# EAGLE schematic schematic_March8 (EAGLE 9.3.0)
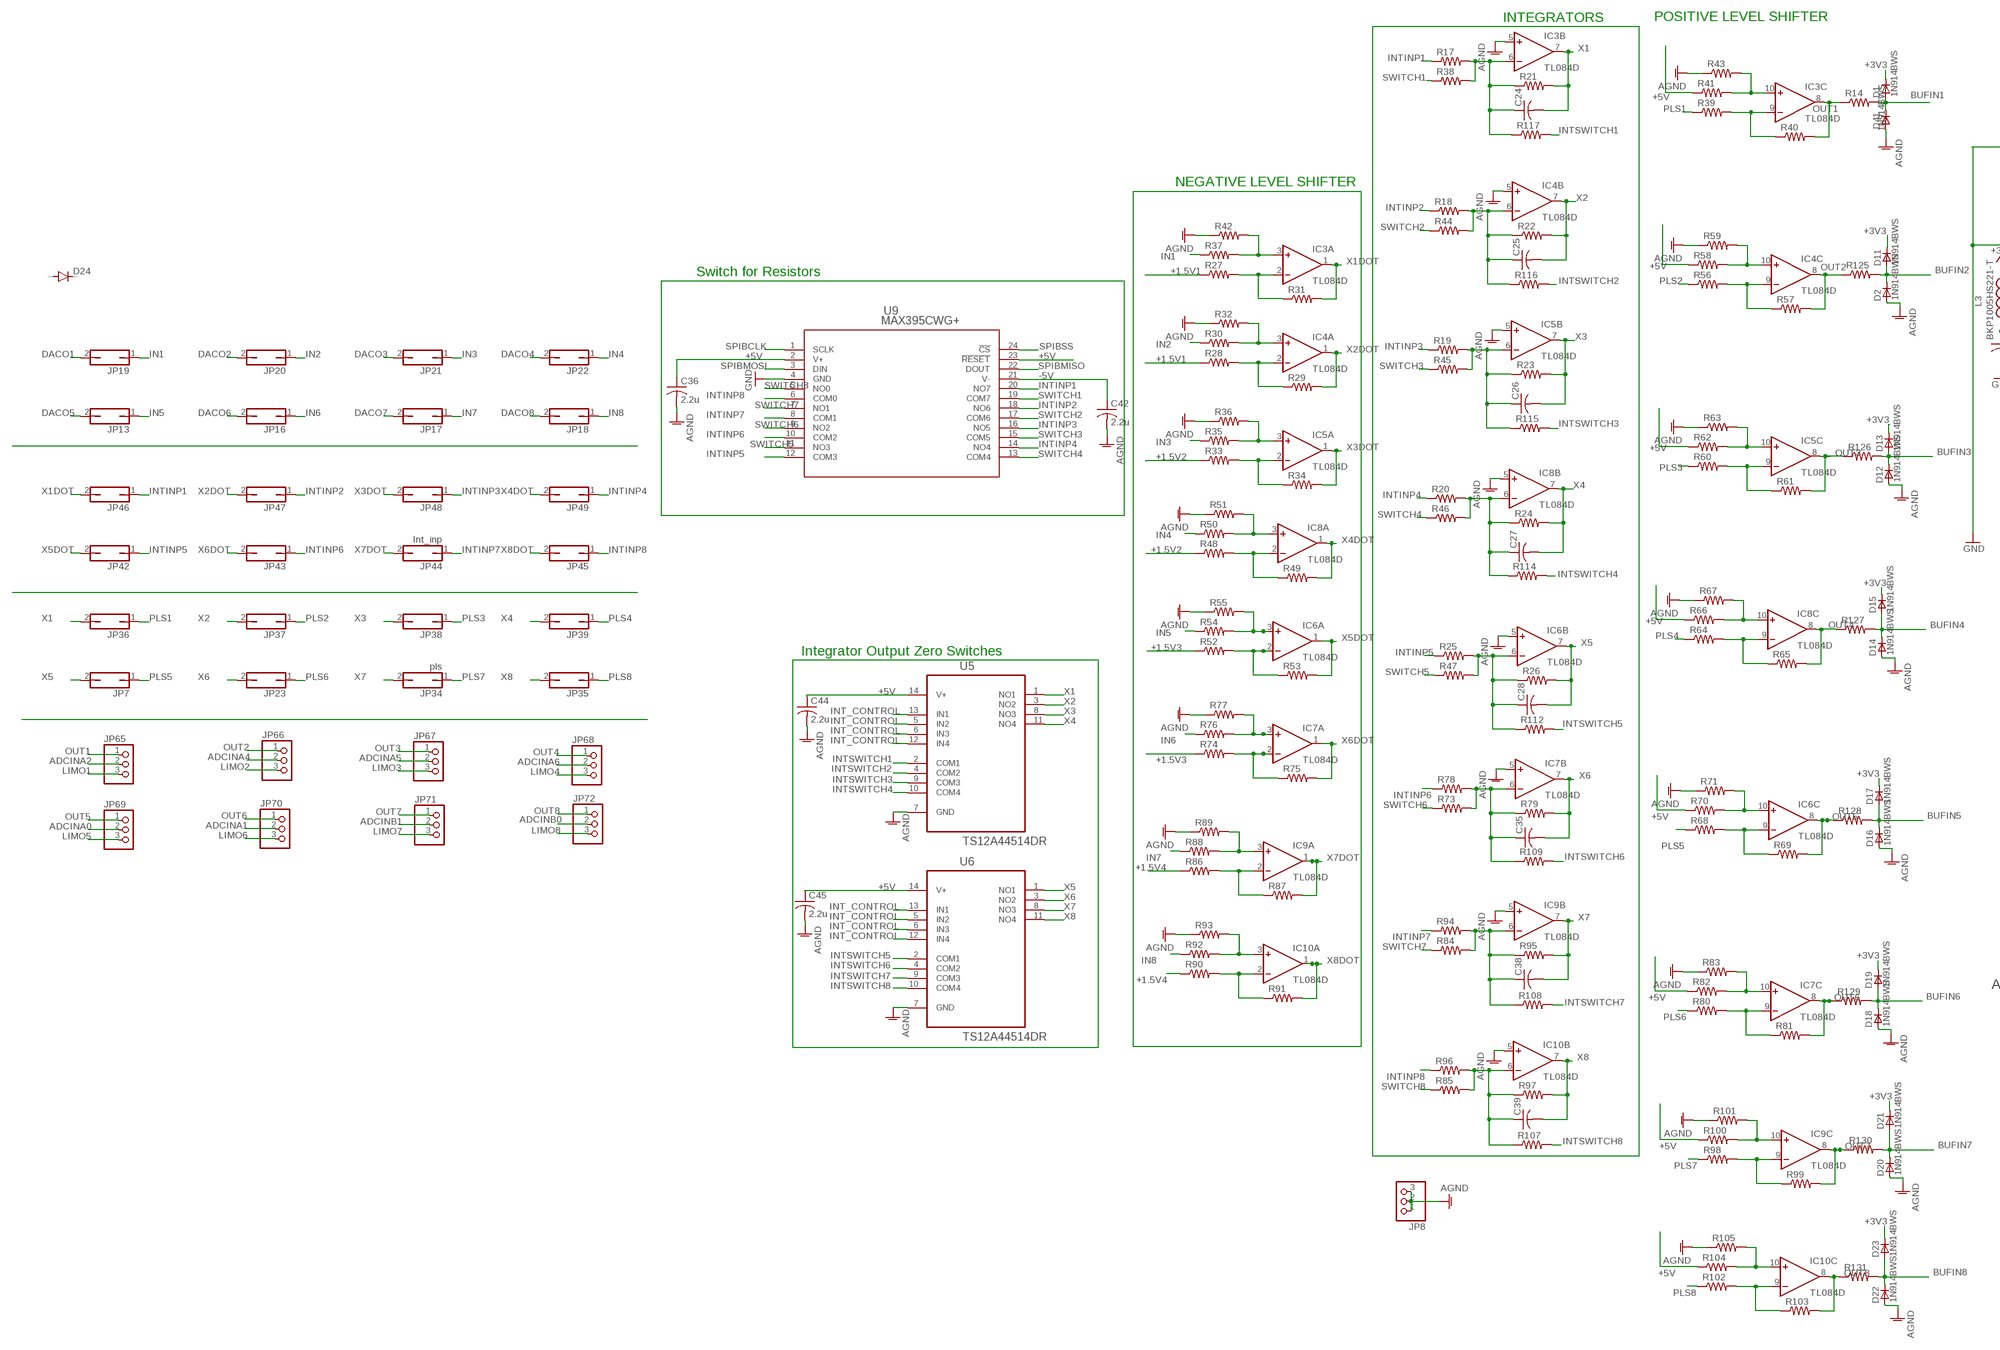
[diagram p0: schematic, sheet 1, part 1 of 2]
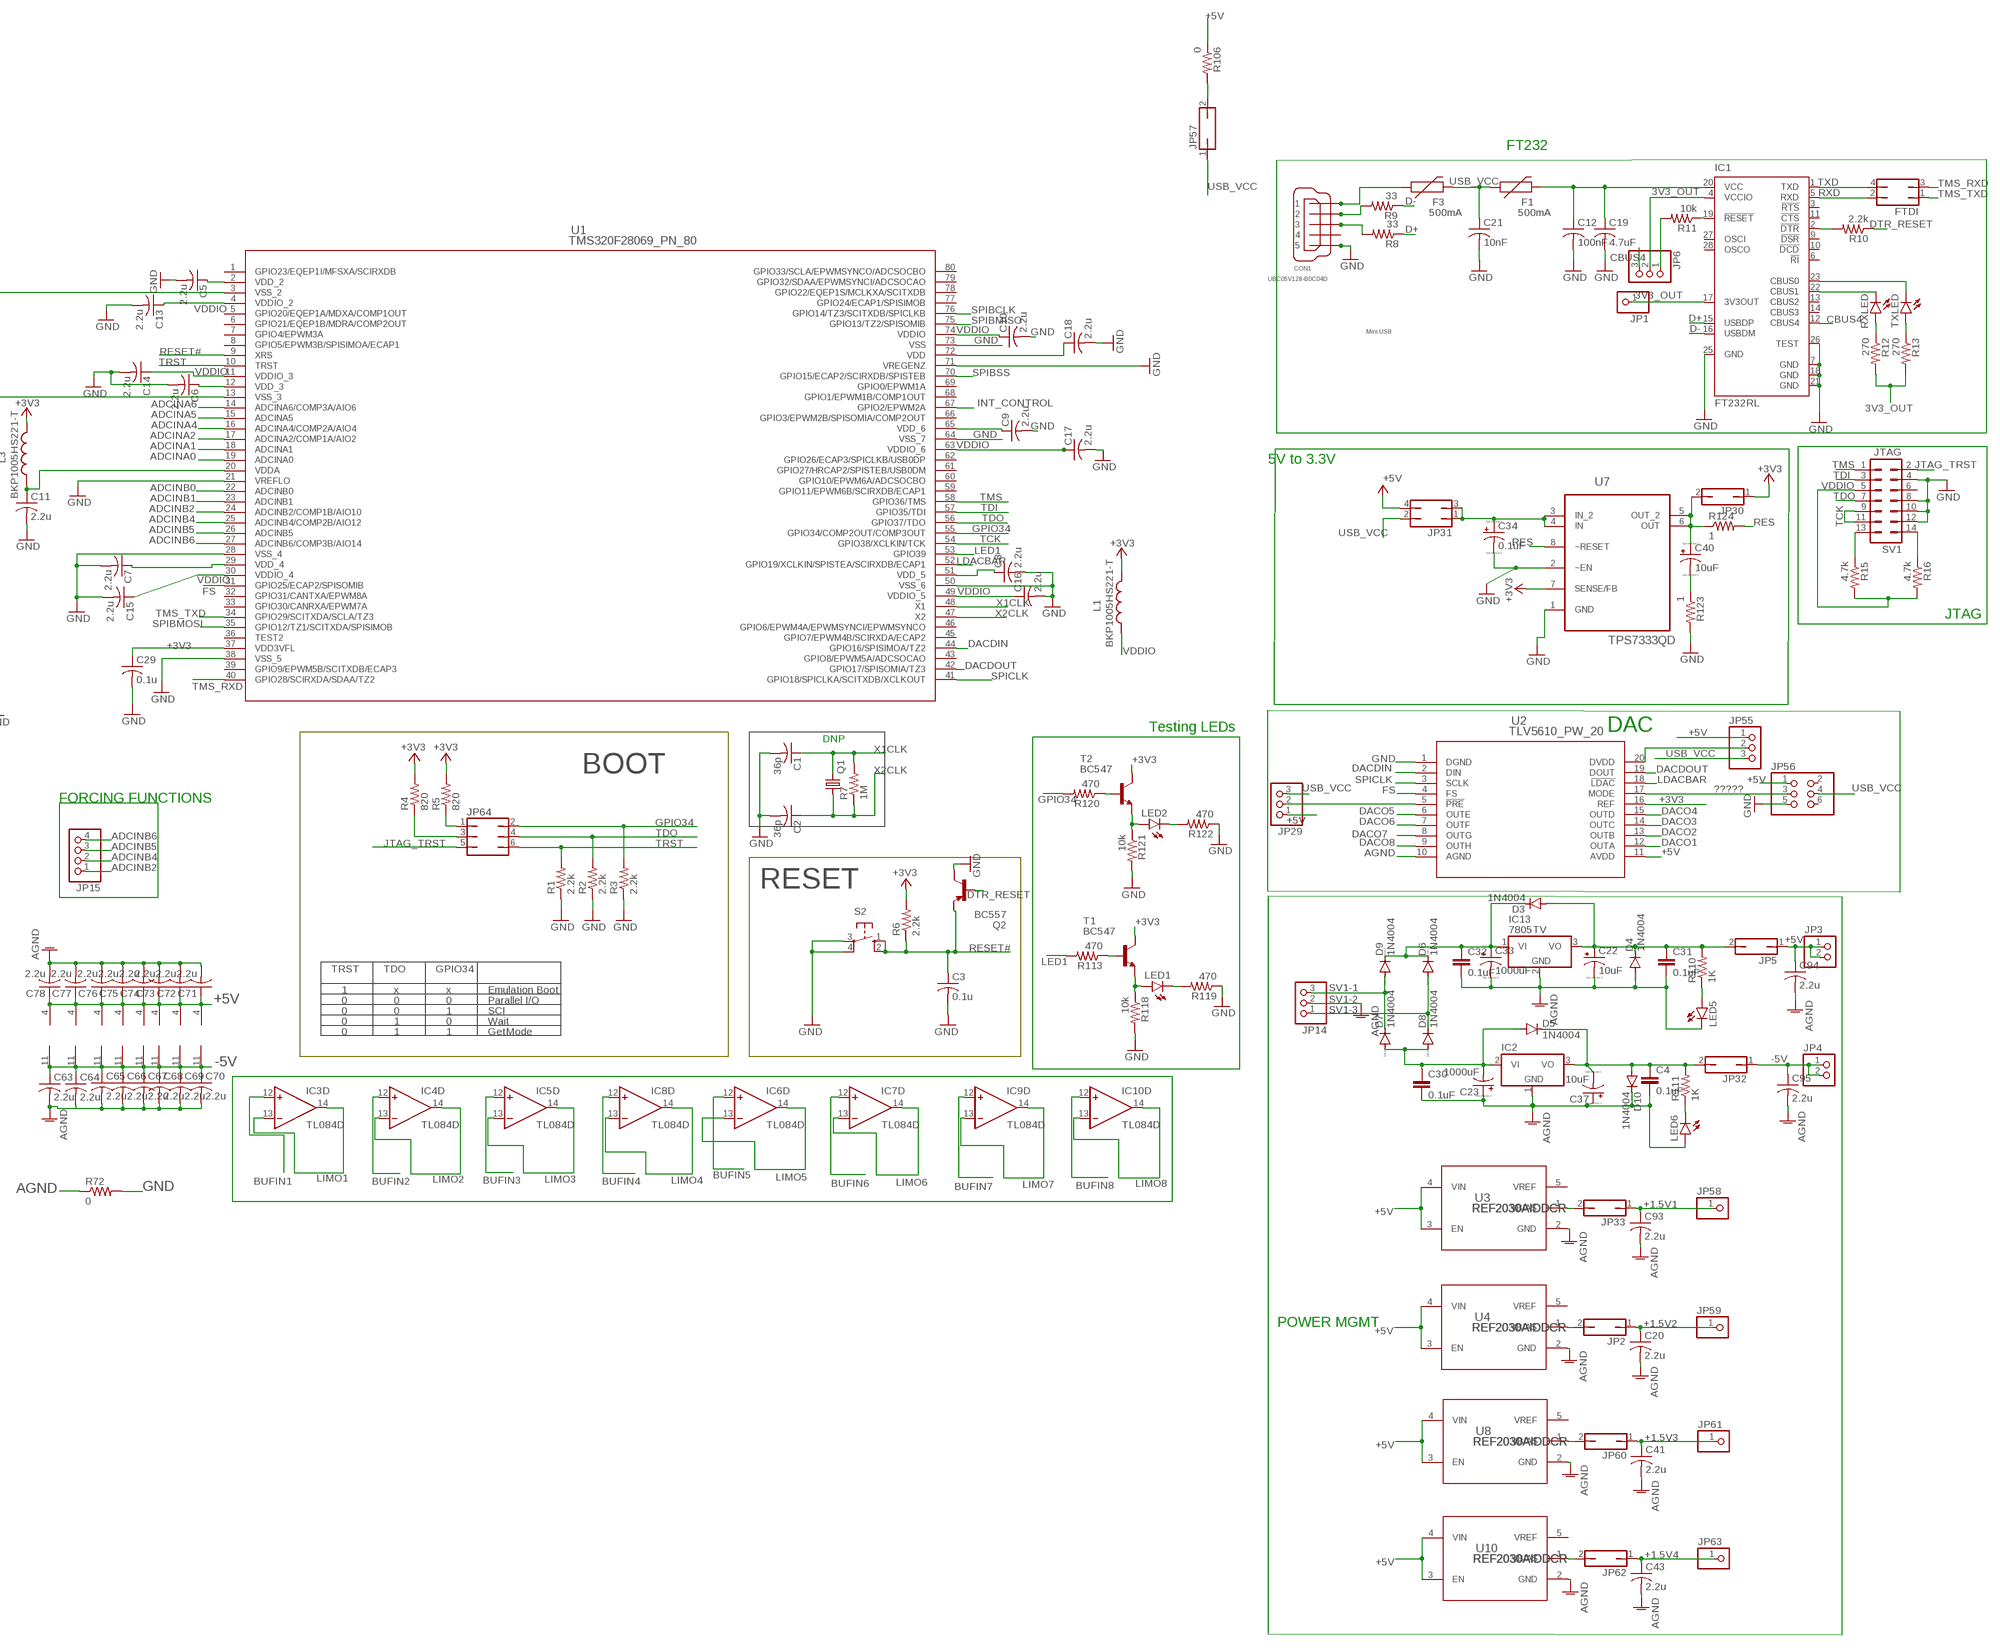
[diagram p1: schematic, sheet 1, part 2 of 2]

## Parts
C1  36p  C-USC1206  [C1206]
C2  36p  C-USC1206  [C1206]
C3  0.1u  C-USC1206  [C1206]
C4  0.1uF  C-EUC1206  [C1206]
C5  2.2u  C-USC1206  [C1206]
C6  2.2u  C-USC1206  [C1206]
C7  2.2u  C-USC1206  [C1206]
C8  2.2u  C-USC1206  [C1206]
C9  2.2u  C-USC1206  [C1206]
C10  2.2u  C-USC1206  [C1206]
C11  2.2u  C-USC1206  [C1206]
C12  100nF  C-USC1206  [C1206]
C13  2.2u  C-USC1206  [C1206]
C14  2.2u  C-USC1206  [C1206]
C15  2.2u  C-USC1206  [C1206]
C16  2.2u  C-USC1206  [C1206]
C17  2.2u  C-USC1206  [C1206]
C18  2.2u  C-USC1206  [C1206]
C19  4.7uF  C-USC1206  [C1206]
C20  2.2u  C-USC1206  [C1206]
C21  10nF  C-USC1206  [C1206]
C22  10uF  CPOL-USE2.5-7  [E2,5-7]
C23  1000uF  CPOL-USE2.5-7  [E2,5-7]
C24  C-USC1206  [C1206]
C25  C-USC1206  [C1206]
C26  C-USC1206  [C1206]
C27  C-USC1206  [C1206]
C28  C-USC1206  [C1206]
C29  0.1u  C-USC1206  [C1206]
C30  0.1uF  C-EUC1206  [C1206]
C31  0.1uF  C-EUC1206  [C1206]
C32  0.1uF  C-EUC1206  [C1206]
C33  1000uF  CPOL-USE2.5-7  [E2,5-7]
C34  0.1uF  CPOL-USE2.5-7  [E2,5-7]
C35  C-USC1206  [C1206]
C36  2.2u  C-USC1206  [C1206]
C37  10uF  CPOL-USE2.5-7  [E2,5-7]
C38  C-USC1206  [C1206]
C39  C-USC1206  [C1206]
C40  10uF  CPOL-USE2.5-7  [E2,5-7]
C41  2.2u  C-USC1206  [C1206]
C42  2.2u  C-USC1206  [C1206]
C43  2.2u  C-USC1206  [C1206]
C44  2.2u  C-USC1206  [C1206]
C45  2.2u  C-USC1206  [C1206]
C63  2.2u  C-USC1206  [C1206]
C64  2.2u  C-USC1206  [C1206]
C65  2.2u  C-USC1206  [C1206]
C66  2.2u  C-USC1206  [C1206]
C67  2.2u  C-USC1206  [C1206]
C68  2.2u  C-USC1206  [C1206]
C69  2.2u  C-USC1206  [C1206]
C70  2.2u  C-USC1206  [C1206]
C71  2.2u  C-USC1206  [C1206]
C72  2.2u  C-USC1206  [C1206]
C73  2.2u  C-USC1206  [C1206]
C74  2.2u  C-USC1206  [C1206]
C75  2.2u  C-USC1206  [C1206]
C76  2.2u  C-USC1206  [C1206]
C77  2.2u  C-USC1206  [C1206]
C78  2.2u  C-USC1206  [C1206]
C93  2.2u  C-USC1206  [C1206]
C94  2.2u  C-USC1206  [C1206]
C95  2.2u  C-USC1206  [C1206]
CON1  UBC05V128-B0C04D  MINI-USB-32005-201  [32005-201]
D1  1N914BWS  [SOD323F]
D2  1N914BWS  [SOD323F]
D3  1N4004  [DO41-10]
D4  1N4004  [DO41-10]
D5  1N4004  [DO41-10]
D6  1N4004  [DO41-10]
D7  1N4004  [DO41-10]
D8  1N4004  [DO41-10]
D9  1N4004  [DO41-10]
D10  1N4004  [DO41-10]
D11  1N914BWS  [SOD323F]
D12  1N914BWS  [SOD323F]
D13  1N914BWS  [SOD323F]
D14  1N914BWS  [SOD323F]
D15  1N914BWS  [SOD323F]
D16  1N914BWS  [SOD323F]
D17  1N914BWS  [SOD323F]
D18  1N914BWS  [SOD323F]
D19  1N914BWS  [SOD323F]
D20  1N914BWS  [SOD323F]
D21  1N914BWS  [SOD323F]
D22  1N914BWS  [SOD323F]
D23  1N914BWS  [SOD323F]
D24  DIODE-DO214AA  [DO214AA]
D41  1N914BWS  [SOD323F]
F1  500mA  PTC0603  [0603]
F3  500mA  PTC0603  [0603]
FTDI  JP2Q  [JP2Q]
IC1  FT232RL  [SSOP28]
IC2  7905T  [TO220H]
IC3  TL084D  [SO14]
IC4  TL084D  [SO14]
IC5  TL084D  [SO14]
IC6  TL084D  [SO14]
IC7  TL084D  [SO14]
IC8  TL084D  [SO14]
IC9  TL084D  [SO14]
IC10  TL084D  [SO14]
IC13  7805TV  [TO220V]
JP1  PINHD-1X1  [1X01]
JP2  JP1Q  [JP1]
JP3  PINHD-1X2  [1X02]
JP4  PINHD-1X2  [1X02]
JP5  JP1Q  [JP1]
JP6  PINHD-1X3  [1X03]
JP7  JP1Q  [JP1]
JP8  PINHD-1X3  [1X03]
JP13  JP1Q  [JP1]
JP14  PINHD-1X3  [1X03]
JP15  PINHD-1X4  [1X04]
JP16  JP1Q  [JP1]
JP17  JP1Q  [JP1]
JP18  JP1Q  [JP1]
JP19  JP1Q  [JP1]
JP20  JP1Q  [JP1]
JP21  JP1Q  [JP1]
JP22  JP1Q  [JP1]
JP23  JP1Q  [JP1]
JP29  PINHD-1X3  [1X03]
JP30  JP1Q  [JP1]
JP31  JP2Q  [JP2Q]
JP32  JP1Q  [JP1]
JP33  JP1Q  [JP1]
JP34  pls  JP1Q  [JP1]
JP35  JP1Q  [JP1]
JP36  JP1Q  [JP1]
JP37  JP1Q  [JP1]
JP38  JP1Q  [JP1]
JP39  JP1Q  [JP1]
JP42  JP1Q  [JP1]
JP43  JP1Q  [JP1]
JP44  Int_inp  JP1Q  [JP1]
JP45  JP1Q  [JP1]
JP46  JP1Q  [JP1]
JP47  JP1Q  [JP1]
JP48  JP1Q  [JP1]
JP49  JP1Q  [JP1]
JP55  PINHD-1X3  [1X03]
JP56  PINHD-2X3  [2X03]
JP57  JP1Q  [JP1]
JP58  PINHD-1X1  [1X01]
JP59  PINHD-1X1  [1X01]
JP60  JP1Q  [JP1]
JP61  PINHD-1X1  [1X01]
JP62  JP1Q  [JP1]
JP63  PINHD-1X1  [1X01]
JP64  JP3Q  [JP3Q]
JP65  PINHD-1X3  [1X03]
JP66  PINHD-1X3  [1X03]
JP67  PINHD-1X3  [1X03]
JP68  PINHD-1X3  [1X03]
JP69  PINHD-1X3  [1X03]
JP70  PINHD-1X3  [1X03]
JP71  PINHD-1X3  [1X03]
JP72  PINHD-1X3  [1X03]
L1  BKP1005HS221-T  L-US0204/5  [0204/5]
L3  BKP1005HS221-T  L-US0204/5  [0204/5]
LED1  LED3MM  [LED3MM]
LED2  LED3MM  [LED3MM]
LED5  LED3MM  [LED3MM]
LED6  LED3MM  [LED3MM]
Q1  CRYSTALHC49S  [HC49/S]
Q2  BC557  [TO92-EBC]
R1  2.2k  R-US_R1206  [R1206]
R2  2.2k  R-US_R1206  [R1206]
R3  2.2k  R-US_R1206  [R1206]
R4  820  R-US_R1206  [R1206]
R5  820  R-US_R1206  [R1206]
R6  2.2k  R-US_R1206  [R1206]
R7  1M  R-US_R1206  [R1206]
R8  33  R-US_R1206  [R1206]
R9  33  R-US_R1206  [R1206]
R10  2.2k  R-US_R1206  [R1206]
R11  10k  R-US_R1206  [R1206]
R12  270  R-US_R1206  [R1206]
R13  270  R-US_R1206  [R1206]
R14  R-US_R1206  [R1206]
R15  4.7k  R-US_M1206  [M1206]
R16  4.7k  R-US_M1206  [M1206]
R17  R-US_R1206  [R1206]
R18  R-US_R1206  [R1206]
R19  R-US_R1206  [R1206]
R20  R-US_R1206  [R1206]
R21  R-US_R1206  [R1206]
R22  R-US_R1206  [R1206]
R23  R-US_R1206  [R1206]
R24  R-US_R1206  [R1206]
R25  R-US_R1206  [R1206]
R26  R-US_R1206  [R1206]
R27  R-US_R1206  [R1206]
R28  R-US_R1206  [R1206]
R29  R-US_R1206  [R1206]
R30  R-US_R1206  [R1206]
R31  R-US_R1206  [R1206]
R32  R-US_R1206  [R1206]
R33  R-US_R1206  [R1206]
R34  R-US_R1206  [R1206]
R35  R-US_R1206  [R1206]
R36  R-US_R1206  [R1206]
R37  R-US_R1206  [R1206]
R38  R-US_R1206  [R1206]
R39  R-US_R1206  [R1206]
R40  R-US_R1206  [R1206]
R41  R-US_R1206  [R1206]
R42  R-US_R1206  [R1206]
R43  R-US_R1206  [R1206]
R44  R-US_R1206  [R1206]
R45  R-US_R1206  [R1206]
R46  R-US_R1206  [R1206]
R47  R-US_R1206  [R1206]
R48  R-US_R1206  [R1206]
R49  R-US_R1206  [R1206]
R50  R-US_R1206  [R1206]
R51  R-US_R1206  [R1206]
R52  R-US_R1206  [R1206]
R53  R-US_R1206  [R1206]
R54  R-US_R1206  [R1206]
R55  R-US_R1206  [R1206]
R56  R-US_R1206  [R1206]
R57  R-US_R1206  [R1206]
R58  R-US_R1206  [R1206]
R59  R-US_R1206  [R1206]
R60  R-US_R1206  [R1206]
R61  R-US_R1206  [R1206]
R62  R-US_R1206  [R1206]
R63  R-US_R1206  [R1206]
R64  R-US_R1206  [R1206]
R65  R-US_R1206  [R1206]
R66  R-US_R1206  [R1206]
R67  R-US_R1206  [R1206]
R68  R-US_R1206  [R1206]
R69  R-US_R1206  [R1206]
R70  R-US_R1206  [R1206]
R71  R-US_R1206  [R1206]
R72  0  R-US_R1206  [R1206]
R73  R-US_R1206  [R1206]
R74  R-US_R1206  [R1206]
R75  R-US_R1206  [R1206]
R76  R-US_R1206  [R1206]
R77  R-US_R1206  [R1206]
R78  R-US_R1206  [R1206]
R79  R-US_R1206  [R1206]
R80  R-US_R1206  [R1206]
R81  R-US_R1206  [R1206]
R82  R-US_R1206  [R1206]
R83  R-US_R1206  [R1206]
R84  R-US_R1206  [R1206]
R85  R-US_R1206  [R1206]
R86  R-US_R1206  [R1206]
R87  R-US_R1206  [R1206]
R88  R-US_R1206  [R1206]
R89  R-US_R1206  [R1206]
R90  R-US_R1206  [R1206]
R91  R-US_R1206  [R1206]
R92  R-US_R1206  [R1206]
R93  R-US_R1206  [R1206]
R94  R-US_R1206  [R1206]
R95  R-US_R1206  [R1206]
R96  R-US_R1206  [R1206]
R97  R-US_R1206  [R1206]
R98  R-US_R1206  [R1206]
R99  R-US_R1206  [R1206]
R100  R-US_R1206  [R1206]
R101  R-US_R1206  [R1206]
R102  R-US_R1206  [R1206]
R103  R-US_R1206  [R1206]
R104  R-US_R1206  [R1206]
R105  R-US_R1206  [R1206]
R106  0  R-US_R1206  [R1206]
R107  R-US_R1206  [R1206]
R108  R-US_R1206  [R1206]
R109  R-US_R1206  [R1206]
R110  1K  R-US_0207/10  [0207/10]
R111  1K  R-US_0207/10  [0207/10]
R112  R-US_R1206  [R1206]
R113  470  R-US_R1206  [R1206]
R114  R-US_R1206  [R1206]
R115  R-US_R1206  [R1206]
R116  R-US_R1206  [R1206]
R117  R-US_R1206  [R1206]
R118  10k  R-US_R1206  [R1206]
R119  470  R-US_R1206  [R1206]
R120  470  R-US_R1206  [R1206]
R121  10k  R-US_R1206  [R1206]
R122  470  R-US_R1206  [R1206]
R123  1  R-US_M1206  [M1206]
R124  1  R-US_M1206  [M1206]
R125  R-US_R1206  [R1206]
R126  R-US_R1206  [R1206]
R127  R-US_R1206  [R1206]
R128  R-US_R1206  [R1206]
R129  R-US_R1206  [R1206]
R130  R-US_R1206  [R1206]
R131  R-US_R1206  [R1206]
RXLED  LEDCHIPLED_1206  [CHIPLED_1206]
S2  10-XX  [B3F-10XX]
SV1  JTAG  MA07-2  [MA07-2]
T1  BC547  [TO92]
T2  BC547  [TO92]
TXLED  LEDCHIPLED_1206  [CHIPLED_1206]
U1  TMS320F28069_PN_80  [PN80]
U2  TLV5610_PW_20  [PW20]
U3  REF2030AIDDCR  [DDC0005A_N]
U4  REF2030AIDDCR  [DDC0005A_N]
U5  TS12A44514DR  [SOIC127P600X175-14N]
U6  TS12A44514DR  [SOIC127P600X175-14N]
U7  TPS7333QD  [SOIC127P600X175-8N]
U8  REF2030AIDDCR  [DDC0005A_N]
U9  MAX395CWG+  [21-0042B_24]
U10  REF2030AIDDCR  [DDC0005A_N]

## Nets
3V3_OUT: IC1.4(VCCIO) IC1.17(3V3OUT) JP1.1 JP6.2 R12.2 R13.2
+1.5V1: C93.1 JP33.1 JP58.1 R27.1 R28.1
+1.5V2: C20.1 JP2.1 JP59.1 R33.1 R48.1
+1.5V3: C41.1 JP60.1 JP61.1 R52.1 R74.1
+1.5V4: C43.1 JP62.1 JP63.1 R86.1 R90.1
+3V3: C29.1 D1.C D11.C D13.C D15.C D17.C D19.C D21.C D23.C JP30.1 L1.2 L3.2 R4.2 R5.2 R6.2 T1.3(C) T2.3(C) U1.37(VDD3VFL) U2.16(REF) U7.7(SENSE/FB)
+5V: C36.1 C44.1 C45.1 C71.1 C72.1 C73.1 C74.1 C75.1 C76.1 C77.1 C78.1 C94.1 IC3.4(P:V+) IC4.4(P:V+) IC5.4(P:V+) IC6.4(P:V+) IC7.4(P:V+) IC8.4(P:V+) IC9.4(P:V+) IC10.4(P:V+) JP3.1 JP3.2 JP5.1 JP29.1 JP31.4 JP55.1 JP56.1 R41.1 R58.1 R62.1 R66.1 R70.1 R82.1 R100.1 R104.1 R106.1 U2.11(AVDD) U3.3(EN) U3.4(VIN) U4.3(EN) U4.4(VIN) U5.14(V+) U6.14(V+) U8.3(EN) U8.4(VIN) U9.2(V+) U9.23(!RESET) U10.3(EN) U10.4(VIN) ; supply symbol labelled +3V3
-5V: C42.1 C63.1 C64.1 C65.1 C66.1 C67.1 C68.1 C69.1 C70.1 C95.1 IC3.11(P:V-) IC4.11(P:V-) IC5.11(P:V-) IC6.11(P:V-) IC7.11(P:V-) IC8.11(P:V-) IC9.11(P:V-) IC10.11(P:V-) JP4.1 JP4.2 JP32.1 U9.21(V-)
?????: JP56.3 U2.17(MODE)
ADCINA0: JP69.2 U1.19(ADCINA0)
ADCINA1: JP70.2 U1.18(ADCINA1)
ADCINA2: JP65.2 U1.17(ADCINA2/COMP1A/AIO2)
ADCINA4: JP66.2 U1.16(ADCINA4/COMP2A/AIO4)
ADCINA5: JP67.2 U1.15(ADCINA5)
ADCINA6: JP68.2 U1.14(ADCINA6/COMP3A/AIO6)
ADCINB0: JP72.2 U1.22(ADCINB0)
ADCINB1: JP71.2 U1.23(ADCINB1)
ADCINB2: JP15.1 U1.24(ADCINB2/COMP1B/AIO10)
ADCINB4: JP15.2 U1.25(ADCINB4/COMP2B/AIO12)
ADCINB5: JP15.3 U1.26(ADCINB5)
ADCINB6: JP15.4 U1.27(ADCINB6/COMP3B/AIO14)
AGND: C4.2 C20.2 C22.- C23.+ C30.2 C31.2 C32.2 C33.- C36.2 C37.+ C41.2 C42.2 C43.2 C44.2 C45.2 C63.2 C64.2 C65.2 C66.2 C67.2 C68.2 C69.2 C70.2 C71.2 C72.2 C73.2 C74.2 C75.2 C76.2 C77.2 C78.2 C93.2 C94.2 C95.2 D2.A D4.A D10.C D12.A D14.A D16.A D18.A D20.A D22.A D41.A IC2.1(GND) IC3.5(B:+IN) IC4.5(B:+IN) IC5.5(B:+IN) IC6.5(B:+IN) IC7.5(B:+IN) IC8.5(B:+IN) IC9.5(B:+IN) IC10.5(B:+IN) IC13.2(GND) JP8.1 JP8.2 JP8.3 LED5.K(C) LED6.A R32.1 R36.1 R42.1 R43.1 R51.1 R55.1 R59.1 R63.1 R67.1 R71.1 R72.1 R77.1 R83.1 R89.1 R93.1 R101.1 R105.1 U2.10(AGND) U3.2(GND) U4.2(GND) U5.7(GND) U6.7(GND) U8.2(GND) U10.2(GND)
BUFIN1: D1.A D41.C IC3.12(D:+IN) R14.2
BUFIN2: D2.C D11.A IC4.12(D:+IN) R125.2
BUFIN3: D12.C D13.A IC5.12(D:+IN) R126.2
BUFIN4: D14.C D15.A IC8.12(D:+IN) R127.2
BUFIN5: D16.C D17.A IC6.12(D:+IN) R128.2
BUFIN6: D18.C D19.A IC7.12(D:+IN) R129.2
BUFIN7: D20.C D21.A IC9.12(D:+IN) R130.2
BUFIN8: D22.C D23.A IC10.12(D:+IN) R131.2
CBUS4: IC1.12(CBUS4) JP6.3
D+: IC1.15(USBDP) R8.1
D-: IC1.16(USBDM) R9.1
DACDIN: U1.44(GPIO16/SPISIMOA/TZ2) U2.2(DIN)
DACDOUT: U1.42(GPIO17/SPISOMIA/TZ3) U2.19(DOUT)
DACO1: JP19.2 U2.12(OUTA)
DACO2: JP20.2 U2.13(OUTB)
DACO3: JP21.2 U2.14(OUTC)
DACO4: JP22.2 U2.15(OUTD)
DACO5: JP13.2 U2.6(OUTE)
DACO6: JP16.2 U2.7(OUTF)
DACO7: JP17.2 U2.8(OUTG)
DACO8: JP18.2 U2.9(OUTH)
DTR_RESET: Q2.B R10.1
FS: U1.31(GPIO25/ECAP2/SPISOMIB) U2.4(FS)
GND: C1.2 C2.2 C3.2 C5.2 C6.2 C7.2 C8.2 C9.2 C10.2 C11.2 C12.2 C13.2 C14.2 C15.2 C16.2 C17.2 C18.2 C19.2 C21.2 C29.2 C34.- CON1.5 IC1.7(GND) IC1.18(GND) IC1.21(GND) IC1.25(GND) IC1.26(TEST) JP56.5 Q2.C R1.1 R2.1 R3.1 R72.2 R118.2 R119.1 R121.2 R122.1 R123.2 S2.3(P) S2.4(P1) SV1.4 SV1.8 SV1.10 SV1.12 U1.3(VSS_2) U1.13(VSS_3) U1.21(VREFLO) U1.28(VSS_4) U1.38(VSS_5) U1.50(VSS_6) U1.64(VSS_7) U1.71(VREGENZ) U1.73(VSS) U2.1(DGND) U7.1(GND) U7.2(~EN) U9.4(GND)
GPIO34: JP64.2 R3.2 R120.2 U1.55(GPIO34/COMP2OUT/COMP3OUT)
IDK: C22.+ C31.1 D3.A D4.C IC13.3(VO) JP5.2 R110.2
IDK2: C4.1 C37.- D5.C D10.A IC2.3(VO) JP32.2 R111.2
IN1: JP19.1 R37.1
IN2: JP20.1 R30.1
IN3: JP21.1 R35.1
IN4: JP22.1 R50.1
IN5: JP13.1 R54.1
IN6: JP16.1 R76.1
IN7: JP17.1 R88.1
IN8: JP18.1 R92.1
INT_CONTROL: U1.67(GPIO2/EPWM2A) U5.5(IN2) U5.6(IN3) U5.12(IN4) U5.13(IN1) U6.5(IN2) U6.6(IN3) U6.12(IN4) U6.13(IN1)
INTINP1: JP46.1 R17.1 U9.20(NO7)
INTINP2: JP47.1 R18.1 U9.18(NO6)
INTINP3: JP48.1 R19.1 U9.16(NO5)
INTINP4: JP49.1 R20.1 U9.14(NO4)
INTINP5: JP42.1 R25.1 U9.12(COM3)
INTINP6: JP43.1 R78.1 U9.10(COM2)
INTINP7: JP44.1 R94.1 U9.8(COM1)
INTINP8: JP45.1 R96.1 U9.6(COM0)
INTSWITCH1: R117.2 U5.2(COM1)
INTSWITCH2: R116.2 U5.4(COM2)
INTSWITCH3: R115.2 U5.9(COM3)
INTSWITCH4: R114.2 U5.10(COM4)
INTSWITCH5: R112.2 U6.2(COM1)
INTSWITCH6: R109.2 U6.4(COM2)
INTSWITCH7: R108.2 U6.9(COM3)
INTSWITCH8: R107.2 U6.10(COM4)
JTAG_TRST: JP64.5 SV1.2
LDACBAR: U1.52(GPIO19/XCLKIN/SPISTEA/SCIRXDB/ECAP1) U2.18(!LDAC)
LED1: R113.2 U1.53(GPIO39)
LIMO1: IC3.13(D:-IN) IC3.14(D:OUT) JP65.3
LIMO2: IC4.13(D:-IN) IC4.14(D:OUT) JP66.3
LIMO3: IC5.13(D:-IN) IC5.14(D:OUT) JP67.3
LIMO4: IC8.13(D:-IN) IC8.14(D:OUT) JP68.3
LIMO5: IC6.13(D:-IN) IC6.14(D:OUT) JP69.3
LIMO6: IC7.13(D:-IN) IC7.14(D:OUT) JP70.3
LIMO7: IC9.13(D:-IN) IC9.14(D:OUT) JP71.3
LIMO8: IC10.13(D:-IN) IC10.14(D:OUT) JP72.3
N$1: C5.1 U1.2(VDD_2)
N$2: C6.1 U1.12(VDD_3)
N$3: C7.1 U1.29(VDD_4)
N$4: C8.1 U1.51(VDD_5)
N$5: C9.1 U1.65(VDD_6)
N$6: IC1.2(!DTR) R10.2
N$7: C11.1 L3.1 U1.20(VDDA)
N$8: C18.1 U1.72(VDD)
N$9: JP64.1 R5.1
N$10: JP64.3 R4.1
N$11: CON1.2 R9.2
N$12: CON1.3 R8.2
N$13: IC1.19(!RESET) R11.1
N$14: IC1.22(CBUS1) RXLED.C
N$15: IC1.23(CBUS0) TXLED.C
N$16: R12.1 RXLED.A
N$17: R13.1 TXLED.A
N$20: C25.1 IC4.6(B:-IN) R18.2 R22.1 R44.2 R116.1
N$21: C26.1 IC5.6(B:-IN) R19.2 R23.1 R45.2 R115.1
N$22: C27.1 IC8.6(B:-IN) R20.2 R24.1 R46.2 R114.1
N$23: IC4.2(A:-IN) R28.2 R29.1
N$24: R15.1 SV1.13
N$25: R16.1 SV1.14
N$26: IC4.3(A:+IN) R30.2 R32.2
N$28: C24.1 IC3.6(B:-IN) R17.2 R21.1 R38.2 R117.1
N$29: IC3.2(A:-IN) R27.2 R31.1
N$30: C28.1 IC6.6(B:-IN) R25.2 R26.1 R47.2 R112.1
N$31: IC5.2(A:-IN) R33.2 R34.1
N$33: IC3.3(A:+IN) R37.2 R42.2
N$35: IC5.3(A:+IN) R35.2 R36.2
N$36: IC3.9(C:-IN) R39.2 R40.1
N$38: IC3.10(C:+IN) R41.2 R43.2
N$39: IC8.2(A:-IN) R48.2 R49.1
N$40: IC8.3(A:+IN) R50.2 R51.2
N$41: IC7.2(A:-IN) R74.2 R75.1
N$42: IC6.2(A:-IN) R52.2 R53.1
N$44: IC6.3(A:+IN) R54.2 R55.2
N$45: IC7.3(A:+IN) R76.2 R77.2
N$47: IC4.9(C:-IN) R56.2 R57.1
N$48: IC4.10(C:+IN) R58.2 R59.2
N$49: IC5.9(C:-IN) R60.2 R61.1
N$50: IC5.10(C:+IN) R62.2 R63.2
N$51: IC8.9(C:-IN) R64.2 R65.1
N$52: IC8.10(C:+IN) R66.2 R67.2
N$53: IC6.9(C:-IN) R68.2 R69.1
N$54: IC6.10(C:+IN) R70.2 R71.2
N$55: C35.1 IC7.6(B:-IN) R73.2 R78.2 R79.1 R109.1
N$56: IC7.9(C:-IN) R80.2 R81.1
N$57: IC7.10(C:+IN) R82.2 R83.2
N$58: IC9.2(A:-IN) R86.2 R87.1
N$59: IC9.3(A:+IN) R88.2 R89.2
N$60: IC10.2(A:-IN) R90.2 R91.1
N$61: IC10.3(A:+IN) R92.2 R93.2
N$62: C38.1 IC9.6(B:-IN) R84.2 R94.2 R95.1 R108.1
N$63: C39.1 IC10.6(B:-IN) R85.2 R96.2 R97.1 R107.1
N$64: IC9.9(C:-IN) R98.2 R99.1
N$65: IC9.10(C:+IN) R100.2 R101.2
N$66: IC10.9(C:-IN) R102.2 R103.1
N$67: IC10.10(C:+IN) R104.2 R105.2
N$73: C32.1 C33.+ D3.C D6.C D9.C IC13.1(VI)
N$77: C40.+ JP30.2 R124.1 U7.5(OUT_2) U7.6(OUT)
N$78: C40.- R123.1
N$80: LED6.K(C) R111.1
N$81: C34.+ JP31.1 JP31.3 U7.3(IN_2) U7.4(IN)
N$82: LED5.A R110.1
N$83: CON1.1 F3.1
N$86: C23.- C30.1 D5.A D7.A D8.A IC2.2(VI)
N$91: JP33.2 U3.1(VBIAS)
N$95: JP6.1 R11.2
N$102: R113.1 T1.2(B)
N$104: LED1.A R118.1 T1.1(E)
N$105: LED1.K(C) R119.2
N$106: R120.1 T2.2(B)
N$107: LED2.A R121.1 T2.1(E)
N$108: LED2.K(C) R122.2
N$131: JP55.2 U2.20(DVDD)
N$132: JP2.2 U4.1(VBIAS)
N$133: JP29.2 U2.5(!PRE)
N$134: JP57.2 R106.2
N$135: JP60.2 U8.1(VBIAS)
N$136: JP62.2 U10.1(VBIAS)
OUT1: IC3.8(C:OUT) JP65.1 R14.1 R40.2
OUT2: IC4.8(C:OUT) JP66.1 R57.2 R125.1
OUT3: IC5.8(C:OUT) JP67.1 R61.2 R126.1
OUT4: IC8.8(C:OUT) JP68.1 R65.2 R127.1
OUT5: IC6.8(C:OUT) JP69.1 R69.2 R128.1
OUT6: IC7.8(C:OUT) JP70.1 R81.2 R129.1
OUT7: IC9.8(C:OUT) JP71.1 R99.2 R130.1
OUT8: IC10.8(C:OUT) JP72.1 R103.2 R131.1
PLS1: JP36.1 R39.1
PLS2: JP37.1 R56.1
PLS3: JP38.1 R60.1
PLS4: JP39.1 R64.1
PLS5: JP7.1 R68.1
PLS6: JP23.1 R80.1
PLS7: JP34.1 R98.1
PLS8: JP35.1 R102.1
RES: R124.2 U7.8(~RESET)
RESET#: C3.1 Q2.E R6.1 S2.1(S) S2.2(S1) U1.9(XRS)
RXD: FTDI.2 IC1.5(RXD)
SPIBCLK: U1.76(GPIO14/TZ3/SCITXDB/SPICLKB) U9.1(SCLK)
SPIBMISO: U1.75(GPIO13/TZ2/SPISOMIB) U9.22(DOUT)
SPIBMOSI: U1.35(GPIO12/TZ1/SCITXDA/SPISIMOB) U9.3(DIN)
SPIBSS: U1.70(GPIO15/ECAP2/SCIRXDB/SPISTEB) U9.24(!CS)
SPICLK: U1.41(GPIO18/SPICLKA/SCITXDB/XCLKOUT) U2.3(SCLK)
SV1-1: D7.C D9.A JP14.3
SV1-2: JP14.2 ; supply symbol labelled AGND
SV1-3: D6.A D8.C JP14.1
SWITCH1: R38.1 U9.19(COM7)
SWITCH2: R44.1 U9.17(COM6)
SWITCH3: R45.1 U9.15(COM5)
SWITCH4: R46.1 U9.13(COM4)
SWITCH5: R47.1 U9.11(NO3)
SWITCH6: R73.1 U9.9(NO2)
SWITCH7: R84.1 U9.7(NO1)
SWITCH8: R85.1 U9.5(NO0)
TCK: SV1.9 SV1.11 U1.54(GPIO38/XCLKIN/TCK)
TDI: SV1.3 U1.57(GPIO35/TDI)
TDO: JP64.4 R2.2 SV1.7 U1.56(GPIO37/TDO)
TMS: SV1.1 U1.58(GPIO36/TMS)
TMS_RXD: FTDI.3 U1.40(GPIO28/SCIRXDA/SDAA/TZ2)
TMS_TXD: FTDI.1 U1.34(GPIO29/SCITXDA/SCLA/TZ3)
TRST: JP64.6 R1.2 U1.10(TRST)
TXD: FTDI.4 IC1.1(TXD)
USB_VCC: C21.1 F1.1 F3.2 JP29.3 JP31.2 JP55.3 JP56.4 JP57.1
VCC [power]: C12.1 C19.1 F1.2 IC1.20(VCC)
VDDIO: C10.1 C13.1 C14.1 C15.1 C16.1 C17.1 L1.1 R15.2 R16.2 SV1.5 U1.4(VDDIO_2) U1.11(VDDIO_3) U1.30(VDDIO_4) U1.49(VDDIO_5) U1.63(VDDIO_6) U1.74(VDDIO)
X1: C24.2 IC3.7(B:OUT) JP36.2 R21.2 U5.1(NO1)
X1CLK: C1.1 Q1.2 R7.2 U1.48(X1)
X1DOT: IC3.1(A:OUT) JP46.2 R31.2
X2: C25.2 IC4.7(B:OUT) JP37.2 R22.2 U5.3(NO2)
X2CLK: C2.1 Q1.1 R7.1 U1.47(X2)
X2DOT: IC4.1(A:OUT) JP47.2 R29.2
X3: C26.2 IC5.7(B:OUT) JP38.2 R23.2 U5.8(NO3)
X3DOT: IC5.1(A:OUT) JP48.2 R34.2
X4: C27.2 IC8.7(B:OUT) JP39.2 R24.2 U5.11(NO4)
X4DOT: IC8.1(A:OUT) JP49.2 R49.2
X5: C28.2 IC6.7(B:OUT) JP7.2 R26.2 U6.1(NO1)
X5DOT: IC6.1(A:OUT) JP42.2 R53.2
X6: C35.2 IC7.7(B:OUT) JP23.2 R79.2 U6.3(NO2)
X6DOT: IC7.1(A:OUT) JP43.2 R75.2
X7: C38.2 IC9.7(B:OUT) JP34.2 R95.2 U6.8(NO3)
X7DOT: IC9.1(A:OUT) JP44.2 R87.2
X8: C39.2 IC10.7(B:OUT) JP35.2 R97.2 U6.11(NO4)
X8DOT: IC10.1(A:OUT) JP45.2 R91.2
Unconnected: CON1.4 D24.A D24.C IC1.3(!RTS) IC1.6(!RI) IC1.9(!DSR) IC1.10(!DCD) IC1.11(!CTS) IC1.13(CBUS2) IC1.14(CBUS3) IC1.27(OSCI) IC1.28(OSCO) JP56.2 JP56.6 SV1.6 U1.1(GPIO23/EQEP1I/MFSXA/SCIRXDB) U1.5(GPIO20/EQEP1A/MDXA/COMP1OUT) U1.6(GPIO21/EQEP1B/MDRA/COMP2OUT) U1.7(GPIO4/EPWM3A) U1.8(GPIO5/EPWM3B/SPISIMOA/ECAP1) U1.32(GPIO31/CANTXA/EPWM8A) U1.33(GPIO30/CANRXA/EPWM7A) U1.36(TEST2) U1.39(GPIO9/EPWM5B/SCITXDB/ECAP3) U1.43(GPIO8/EPWM5A/ADCSOCAO) U1.45(GPIO7/EPWM4B/SCIRXDA/ECAP2) U1.46(GPIO6/EPWM4A/EPWMSYNCI/EPWMSYNCO) U1.59(GPIO11/EPWM6B/SCIRXDB/ECAP1) U1.60(GPIO10/EPWM6A/ADCSOCBO) U1.61(GPIO27/HRCAP2/SPISTEB/USB0DM) U1.62(GPIO26/ECAP3/SPICLKB/USB0DP) U1.66(GPIO3/EPWM2B/SPISOMIA/COMP2OUT) U1.68(GPIO1/EPWM1B/COMP1OUT) U1.69(GPIO0/EPWM1A) U1.77(GPIO24/ECAP1/SPISIMOB) U1.78(GPIO22/EQEP1S/MCLKXA/SCITXDB) U1.79(GPIO32/SDAA/EPWMSYNCI/ADCSOCAO) U1.80(GPIO33/SCLA/EPWMSYNCO/ADCSOCBO) U3.5(VREF) U4.5(VREF) U8.5(VREF) U10.5(VREF)

## Notes on the sheet
- FT232
- INTEGRATORS | POSITIVE LEVEL SHIFTER
- NEGATIVE LEVEL SHIFTER | Mini USB
- Switch for Resistors
- 5V to 3.3V
- JTAG
- Testing LEDs | DAC
- DNP
- BOOT
- FORCING FUNCTIONS
- Integrator Output Zero Switches
- RESET
- TRST | TDO | GPIO34
- 1 | x | x | Emulation Boot
- 0 | 0 | 0 | Parallel I/O
- 0 | 0 | 1 | SCI
- 0 | 1 | 0 | Wait
- 0 | 1 | 1 | GetMode
- POWER MGMT

## Library data of the parts
C1-C3 C5-C21 C29 C36 C41-C45 C63-C78 C93-C95 = resistor:C-US: CAPACITOR, American symbol
C4 C30-C32 = rcl:C-EU: CAPACITOR, European symbol; SPICEPREFIX: C
C22 C23 C33 C34 C37 C40 = resistor:CPOL-US: POLARIZED CAPACITOR, American symbol
C24-C28 C35 C38 C39 = rcl:C-US: CAPACITOR, American symbol; SPICEPREFIX: C
CON1 = con-cypressindustries:MINI-USB-: MINI USB-B Conector Source: www.cypressindustries.com; OC_FARNELL: unknown; OC_NEWARK: unknown
D1 D2 D11-D23 D41 = many_diodes:1N914BWS: 1N914BWS General Purpose Rectifier SMD-Version of 1N914 Case: MELF-MLL41 = DO 213 AB Author: Dipl.-Ing. FH Rainer Bayer HHN Hochschule Heilbronn, rainer.bayer@hs-heilbronn.de Ingenieurbüro ing-rb, mail@ing-rb.de
D3-D10 = diode:1N4004: DIODE general purpose rectifier, 1 A
D24 = diode:DIODE-: DIODE
F1 F3 = SparkFun:PTC: Resettable Fuse PTC Resettable Fuse. Spark Fun Electronics SKU : COM-08357
FTDI JP31 = jumper:JP2Q: JUMPER
IC1 = ftdichip:FT232R: Source: http://www.ftdichip.com/Documents/DataSheets/DS_FT232R_v104.pdf; MPN: FT232RL; OC_FARNELL: 1146032; OC_NEWARK: 91K9918
IC2 = linear:79*: Negative VOLTAGE REGULATOR
IC3-IC10 = linear:TL084: OP AMP
IC13 = linear:78*: Positive VOLTAGE REGULATOR Source: http://cache.national.com/ds/LM/LM78L05.pdf http://www.fairchildsemi.com/ds/LM/LM7805.pdf
JP1 JP58 JP59 JP61 JP63 = pinhead:PINHD-1X1: PIN HEADER
JP2 JP5 JP7 JP13 JP16-JP23 JP30 JP32-JP39 JP42-JP49 JP57 JP60 JP62 = jumper:JP1Q: JUMPER
JP3 JP4 = pinhead:PINHD-1X2: PIN HEADER
JP6 JP8 JP14 JP29 JP55 JP65-JP72 = pinhead:PINHD-1X3: PIN HEADER
JP15 = pinhead:PINHD-1X4: PIN HEADER
JP56 = pinhead:PINHD-2X3: PIN HEADER
JP64 = jumper:JP3Q: JUMPER
L1 L3 = rcl:L-US: INDUCTOR, American symbol; SPICEPREFIX: L
LED1 LED2 LED5 LED6 RXLED TXLED = led:LED: LED OSRAM: - CHIPLED LG R971, LG N971, LY N971, LG Q971, LY Q971, LO R971, LY R971 LH N974, LH R974 LS Q976, LO Q976, LY Q976 LO Q996 - Hyper CHIPLED LW Q18S LB Q993, LB Q99A, LB R99A - SideLED LS A670, LO A670, LY A670, LG A670, LP A670 LB A673, LV A673, LT A673, LW A673 LH A674 LY A675 LS A676, LA A676, LO A676, LY A676, LW A676 LS A679, LY A679, LG A679 - Hyper Micro SIDELED® LS Y876, LA Y876, LO Y876, LY Y876 LT Y87S - SmartLED LW L88C, LW L88S LB L89C, LB L89S, LG L890 LS L89K, LO L89K, LY L89K LS L896, LA L896, LO L896, LY L896 - TOPLED LS T670, LO T670, LY T670, LG T670, LP T670 LSG T670, LSP T670, LSY T670, LOP T670, LYG T670 LG T671, LOG T671, LSG T671 LB T673, LV T673, LT T673, LW T673 LH T674 LS T676, LA T676, LO T676, LY T676, LB T676, LH T676, LSB T676, LW T676 LB T67C, LV T67C, LT T67C, LS T67K, LO T67K, LY T67K, LW E67C LS E67B, LA E67B, LO E67B, LY E67B, LB E67C, LV E67C, LT E67C LW T67C LS T679, LY T679, LG T679 LS T770, LO T770, LY T770, LG T770, LP T770 LB T773, LV T773, LT T773, LW T773 LH T774 LS E675, LA E675, LY E675, LS T675 LS T776, LA T776, LO T776, LY T776, LB T776 LHGB T686 LT T68C, LB T68C - Hyper Mini TOPLED® LB M676 - Mini TOPLED Santana® LG M470 LS M47K, LO M47K, LY M47K Source: http://www.osram.convergy.de LUXEON: - LUMILED® LXK2-PW12-R00, LXK2-PW12-S00, LXK2-PW14-U00, LXK2-PW14-V00 LXK2-PM12-R00, LXK2-PM12-S00, LXK2-PM14-U00 LXK2-PE12-Q00, LXK2-PE12-R00, LXK2-PE12-S00, LXK2-PE14-T00, LXK2-PE14-U00 LXK2-PB12-K00, LXK2-PB12-L00, LXK2-PB12-M00, LXK2-PB14-N00, LXK2-PB14-P00, LXK2-PB14-Q00 LXK2-PR12-L00, LXK2-PR12-M00, LXK2-PR14-Q00, LXK2-PR14-R00 LXK2-PD12-Q00, LXK2-PD12-R00, LXK2-PD12-S00 LXK2-PH12-R00, LXK2-PH12-S00 LXK2-PL12-P00, LXK2-PL12-Q00, LXK2-PL12-R00 Source: www.luxeon.com KINGBRIGHT: KA-3528ASYC Source: www.kingbright.com
Q1 = crystal:CRYSTAL: CRYSTAL; OC_FARNELL: 1667008; OC_NEWARK: unknown
Q2 = transistor-pnp:BC557*: PNP Transistror
R1-R13 R106 R110 R111 R113 R118-R122 = resistor:R-US_: RESISTOR, American symbol
R14-R105 R107-R109 R112 R114-R117 R123-R131 = rcl:R-US_: RESISTOR, American symbol; SPICEPREFIX: R
S2 = switch-omron:10-XX: OMRON SWITCH; MPN: B3F-1000; OC_FARNELL: 176432; OC_NEWARK: 36M3542
SV1 = con-lstb:MA07-2: PIN HEADER; OC_FARNELL: unknown; OC_NEWARK: unknown
T1 T2 = transistor-neu-to92:BC547: NPN TRANSISTOR
U1 = uP:TMS320F28069_PN_80; MANUFACTURER_PART_NUMBER: tms320f28069_pn_80; VENDOR: Texas Instruments
U2 = TLV5610:TLV5610_PW_20; MANUFACTURER_PART_NUMBER: tlv5610_pw_20; VENDOR: Texas Instruments
U3 U4 U8 U10 = ref2030:REF2030AIDDCR
U5 U6 = Texas Instruments_By_element14_Batch_1:TS12A44514DR: QUAD SPST CMOS ANALOG SWITCHES; MPN: TS12A44514DR; OC_FARNELL: 1755398; OC_NEWARK: 95M0176; PACKAGE: SOIC-14; SUPPLIER: Texas Instruments
U7 = Texas Instruments_By_element14_Batch_1:TPS7333QD: LOW-DROPOUT VOLTAGE REGULATORS; MPN: TPS7333QD; OC_FARNELL: -; OC_NEWARK: 52F2803; PACKAGE: SOIC-8; SUPPLIER: Texas Instruments
U9 = MAX395:MAX395CWG+; MANUFACTURER_PART_NUMBER: MAX395CWG+; VENDOR: Maxim Integrated Products

## Net classes
0 default: width 0.203 mm
1 power: width 0.254 mm